# EAGLE schematic MPU6050_version_2 (EAGLE 9.3.0)
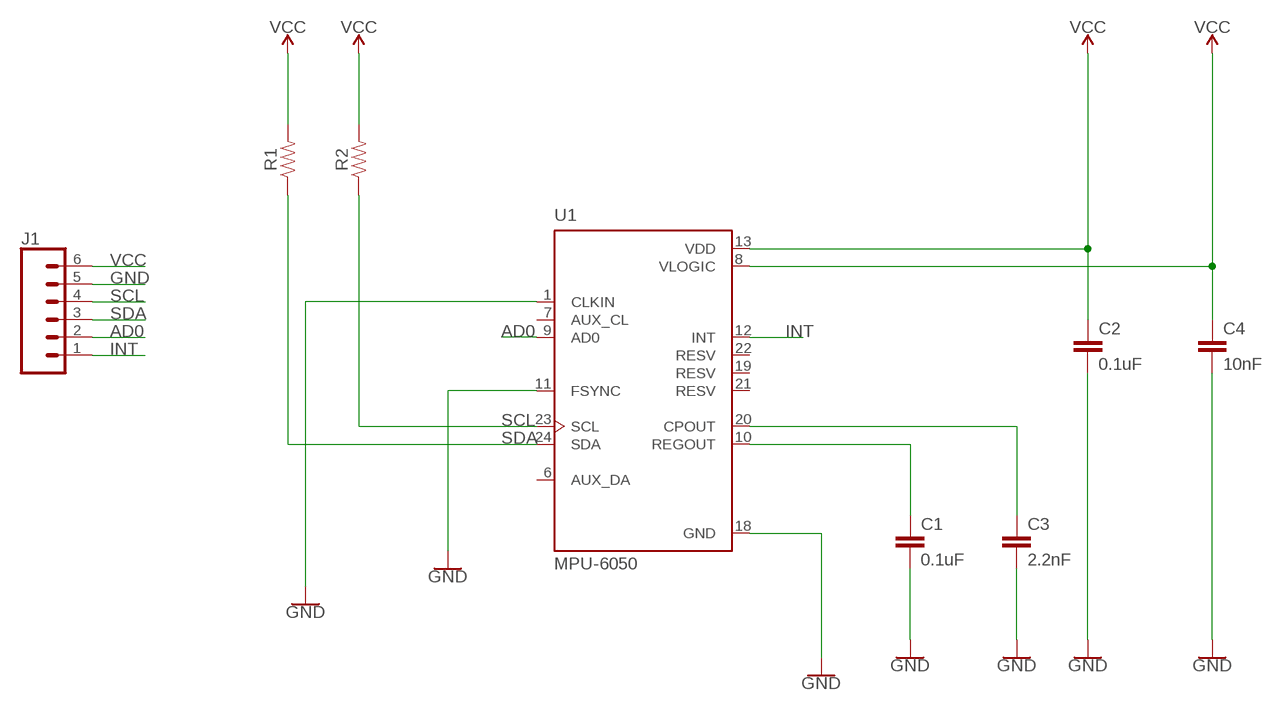
[diagram p0: schematic, sheet 1]

## Parts
C1  0.1uF  1.0UF-0805-25V-10%  [0805]
C2  0.1uF  1.0UF-0805-25V-10%  [0805]
C3  2.2nF  1.0UF-0805-25V-10%  [0805]
C4  10nF  1.0UF-0805-25V-10%  [0805]
J1  CONN_06NO_SILK_FEMALE_PTH  [1X06_NO_SILK]
R1  RESISTOR0805  [0805]
R2  RESISTOR0805  [0805]
U1  MPU-6050  [QFN50P400X400X95-24N]

## Nets
AD0: J1.2 U1.9(AD0)
GND: C1.2 C2.2 C3.2 C4.2 J1.5 U1.1(CLKIN) U1.11(FSYNC) U1.18(GND)
INT: J1.1 U1.12(INT)
N$1: C1.1 U1.10(REGOUT)
N$2: C3.1 U1.20(CPOUT)
SCL: J1.4 R2.1 U1.23(SCL)
SDA: J1.3 R1.1 U1.24(SDA)
VCC: C2.1 C4.1 J1.6 R1.2 R2.2 U1.8(VLOGIC) U1.13(VDD)
Unconnected: U1.6(AUX_DA) U1.7(AUX_CL) U1.19(RESV) U1.21(RESV) U1.22(RESV)

## Library data of the parts
C1-C4 = SparkFun-Capacitors:1.0UF: 1µF ceramic capacitors A capacitor is a passive two-terminal electrical component used to store electrical energy temporarily in an electric field.; PROD_ID: CAP-08064; VALUE: 1.0uF
J1 = SparkFun-Connectors:CONN_06: Multi connection point. Often used as Generic Header-pin footprint for 0.1 inch spaced/style header connections On any of the 0.1 inch spaced packages, you can populate with these: Break Away Headers - Straight <https://www.sparkfun.com/products/116> (PRT-00116) Break Away Male Headers - Right Angle <https://www.sparkfun.com/products/553> (PRT-00553) Female Headers <https://www.sparkfun.com/products/115> (PRT-00115) Break Away Headers - Machine Pin <https://www.sparkfun.com/products/117> (PRT-00117) Break Away Female Headers - Swiss Machine Pin <https://www.sparkfun.com/products/743> (PRT-00743) Arduino Stackable Header - 6 Pin <https://www.sparkfun.com/products/9280> (PRT-09280) For SCREWTERMINALS and SPRING TERMINALS visit here: Screw Terimnals on SparkFun.com <https://www.sparkfun.com/search/results?term=Screw+Terminals> (5mm/3.5mm/2.54mm spacing) This device is also useful as a general connection point to wire up your design to another part of your project. Our various solder wires solder well into these plated through hole pads. Hook-Up Wire - Assortment (Stranded, 22 AWG) <https://www.sparkfun.com/products/11375> (PRT-11375) Hook-Up Wire - Assortment (Solid Core, 22 AWG) <https://www.sparkfun.com/products/11367> (PRT-11367) View the entire wire category on our website here <https://www.sparkfun.com/categories/141>; PROD_ID: CONN-08437
R1 R2 = SparkFun-Resistors:RESISTOR: Generic Resistor Package
U1 = MPU-6050:MPU-6050: MPU-6050 Six-Axis (Gyro + Accelerometer) MEMS MotionTracking™ Devices; DESCRIPTION: 3-axis gyroscope, 3-axis accelerometer in a 4x4x0.9 housing; DIGI-KEY_PART_NUMBER: 1428-1007-1-ND; DIGI-KEY_PURCHASE_URL: https://www.digikey.co.uk/product-detail/en/tdk-invensense/MPU-6050/1428-1007-1-ND/4038010?utm_source=snapeda&utm_medium=aggregator&utm_campaign=symbol; MF: TDK InvenSense; MP: MPU-6050; PACKAGE: QFN-24 InvenSense